# EAGLE design modulo_sensores (EAGLE 9.6.2)
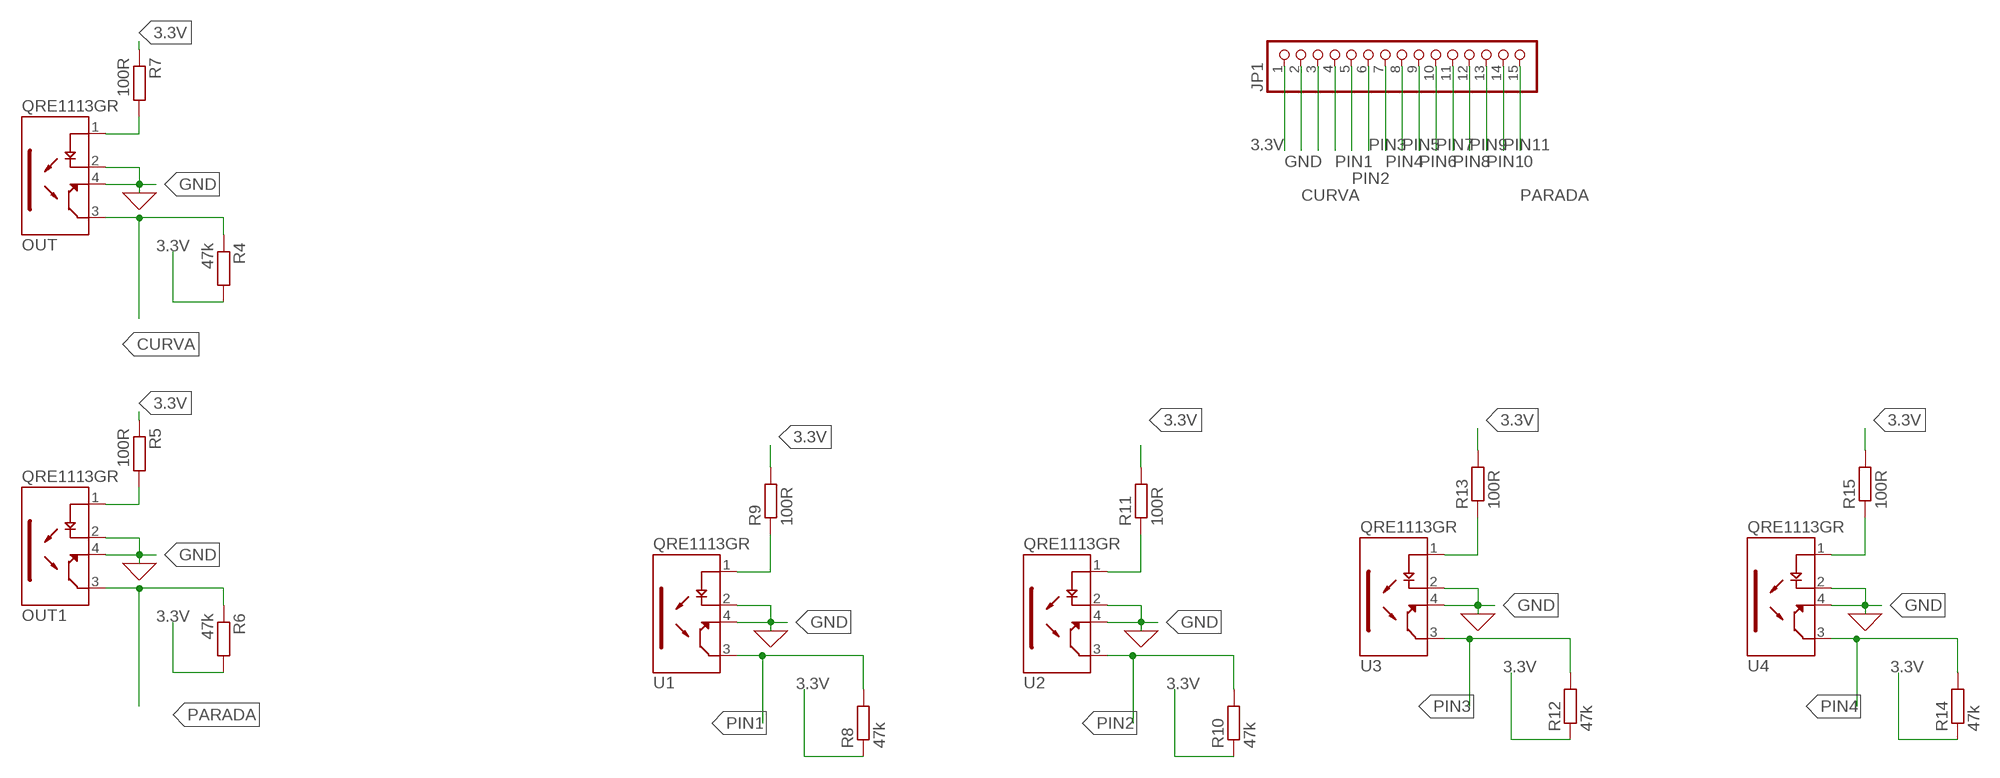
[diagram p0: schematic, sheet 1, part 1 of 2]
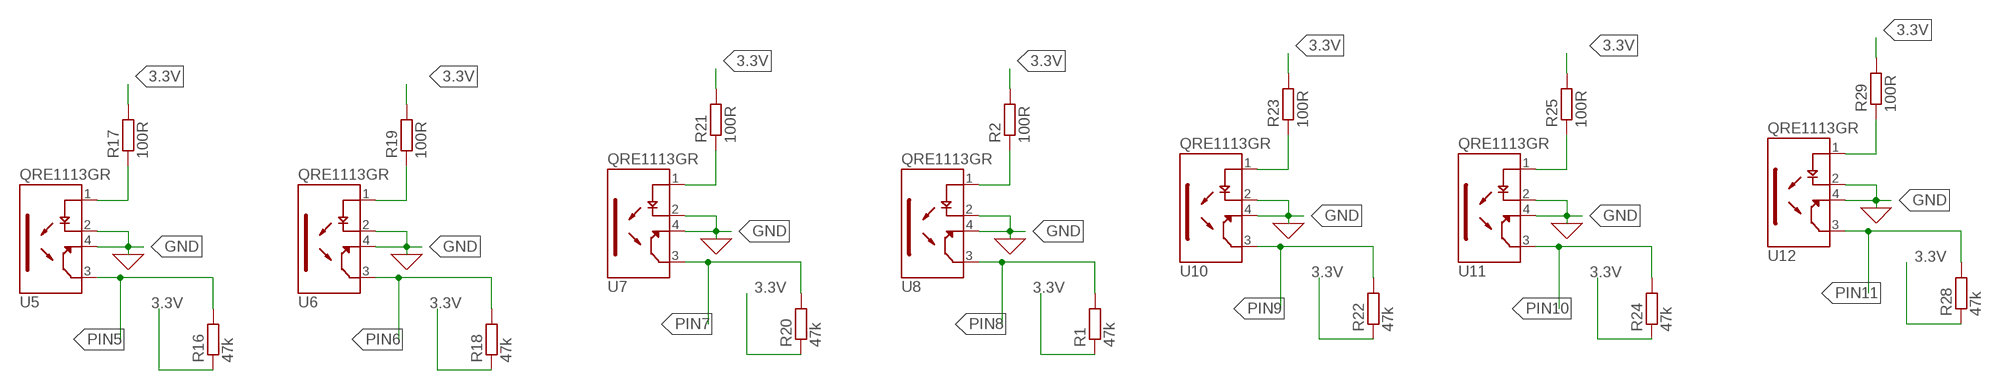
[diagram p1: schematic, sheet 1, part 2 of 2]

## Parts
JP1  PINHD-1X15  [1X15]
OUT  QRE1113GR  [SOIC180P460X187-4N]
OUT1  QRE1113GR  [SOIC180P460X187-4N]
R1  47k  R-EU_M0805  [M0805]
R2  100R  R-EU_M0805  [M0805]
R4  47k  R-EU_R0805  [R0805]
R5  100R  R-EU_R0805  [R0805]
R6  47k  R-EU_R0805  [R0805]
R7  100R  R-EU_R0805  [R0805]
R8  47k  R-EU_M0805  [M0805]
R9  100R  R-EU_M0805  [M0805]
R10  47k  R-EU_M0805  [M0805]
R11  100R  R-EU_M0805  [M0805]
R12  47k  R-EU_M0805  [M0805]
R13  100R  R-EU_M0805  [M0805]
R14  47k  R-EU_M0805  [M0805]
R15  100R  R-EU_M0805  [M0805]
R16  47k  R-EU_M0805  [M0805]
R17  100R  R-EU_M0805  [M0805]
R18  47k  R-EU_M0805  [M0805]
R19  100R  R-EU_M0805  [M0805]
R20  47k  R-EU_M0805  [M0805]
R21  100R  R-EU_M0805  [M0805]
R22  47k  R-EU_M0805  [M0805]
R23  100R  R-EU_M0805  [M0805]
R24  47k  R-EU_M0805  [M0805]
R25  100R  R-EU_M0805  [M0805]
R28  47k  R-EU_M0805  [M0805]
R29  100R  R-EU_M0805  [M0805]
U1  QRE1113GR  [SOIC180P460X187-4N]
U2  QRE1113GR  [SOIC180P460X187-4N]
U3  QRE1113GR  [SOIC180P460X187-4N]
U4  QRE1113GR  [SOIC180P460X187-4N]
U5  QRE1113GR  [SOIC180P460X187-4N]
U6  QRE1113GR  [SOIC180P460X187-4N]
U7  QRE1113GR  [SOIC180P460X187-4N]
U8  QRE1113GR  [SOIC180P460X187-4N]
U10  QRE1113GR  [SOIC180P460X187-4N]
U11  QRE1113GR  [SOIC180P460X187-4N]
U12  QRE1113GR  [SOIC180P460X187-4N]

## Nets
3.3V: JP1.1 R1.1 R2.2 R4.2 R5.1 R6.2 R7.1 R8.1 R9.2 R10.1 R11.2 R12.1 R13.2 R14.1 R15.2 R16.1 R17.2 R18.1 R19.2 R20.1 R21.2 R22.1 R23.2 R24.1 R25.2 R28.1 R29.2
CURVA: JP1.3 OUT.3(CT) R4.1
GND: JP1.2 OUT1.2(C) OUT1.4(ET) OUT.2(C) OUT.4(ET) U1.2(C) U1.4(ET) U2.2(C) U2.4(ET) U3.2(C) U3.4(ET) U4.2(C) U4.4(ET) U5.2(C) U5.4(ET) U6.2(C) U6.4(ET) U7.2(C) U7.4(ET) U8.2(C) U8.4(ET) U10.2(C) U10.4(ET) U11.2(C) U11.4(ET) U12.2(C) U12.4(ET)
N$1: R9.1 U1.1(A)
N$5: OUT.1(A) R7.2
N$6: R11.1 U2.1(A)
N$7: OUT1.1(A) R5.2
N$8: R13.1 U3.1(A)
N$9: R15.1 U4.1(A)
N$10: R17.1 U5.1(A)
N$11: R19.1 U6.1(A)
N$12: R21.1 U7.1(A)
N$13: R2.1 U8.1(A)
N$14: R23.1 U10.1(A)
N$16: R25.1 U11.1(A)
N$17: R29.1 U12.1(A)
PARADA: JP1.15 OUT1.3(CT) R6.1
PIN1: JP1.4 R8.2 U1.3(CT)
PIN2: JP1.5 R10.2 U2.3(CT)
PIN3: JP1.6 R12.2 U3.3(CT)
PIN4: JP1.7 R14.2 U4.3(CT)
PIN5: JP1.8 R16.2 U5.3(CT)
PIN6: JP1.9 R18.2 U6.3(CT)
PIN7: JP1.10 R20.2 U7.3(CT)
PIN8: JP1.11 R1.2 U8.3(CT)
PIN9: JP1.12 R22.2 U10.3(CT)
PIN10: JP1.13 R24.2 U11.3(CT)
PIN11: JP1.14 R28.2 U12.3(CT)

## Library data of the parts
JP1 = pinhead:PINHD-1X15: PIN HEADER
OUT OUT1 U1-U8 U10-U12 = QRE_SENSOR:QRE1113GR: QRE1113 Series 30 V 50 mA Miniature Reflective Object Sensor - SMD-4 Check prices <https://pricing.snapeda.com/parts/QRE1113GR/ON%20Semiconductor/view-part?ref=eda>; AVAILABILITY: In Stock; DESCRIPTION: Reflective Optical Sensor 0.039 (1mm) 4-SMD, Gull Wing; MF: ON Semiconductor; MP: QRE1113GR; PACKAGE: ARUSM-313-4 ON Semiconductor; PRICE: None; PURCHASE-URL: https://pricing.snapeda.com/search/part/QRE1113GR/?ref=eda
R1 R2 R4-R25 R28 R29 = rcl:R-EU_: RESISTOR, European symbol; SPICEPREFIX: R

## Board
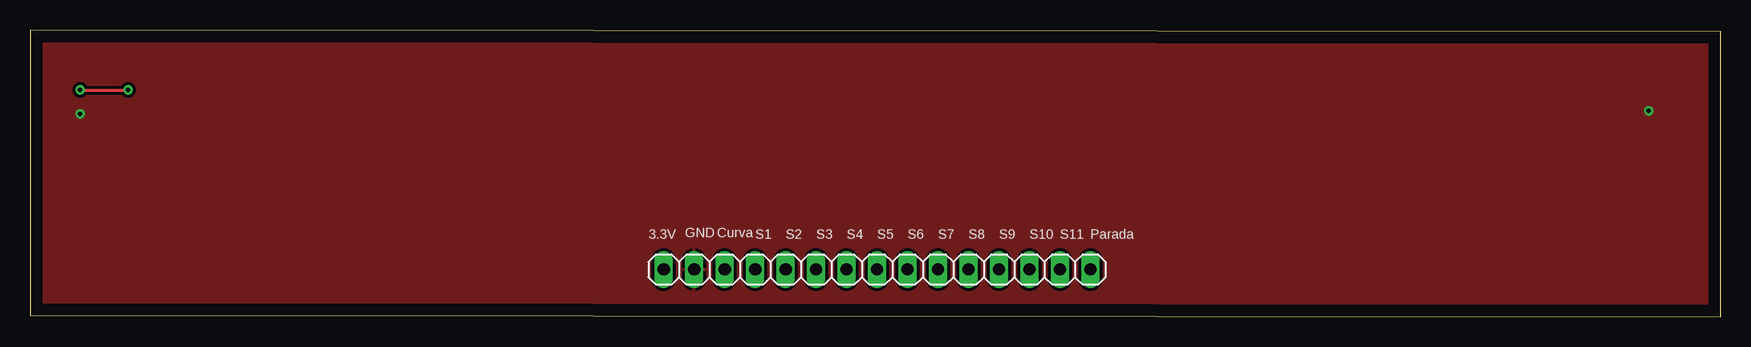
[diagram p2: board, top side]
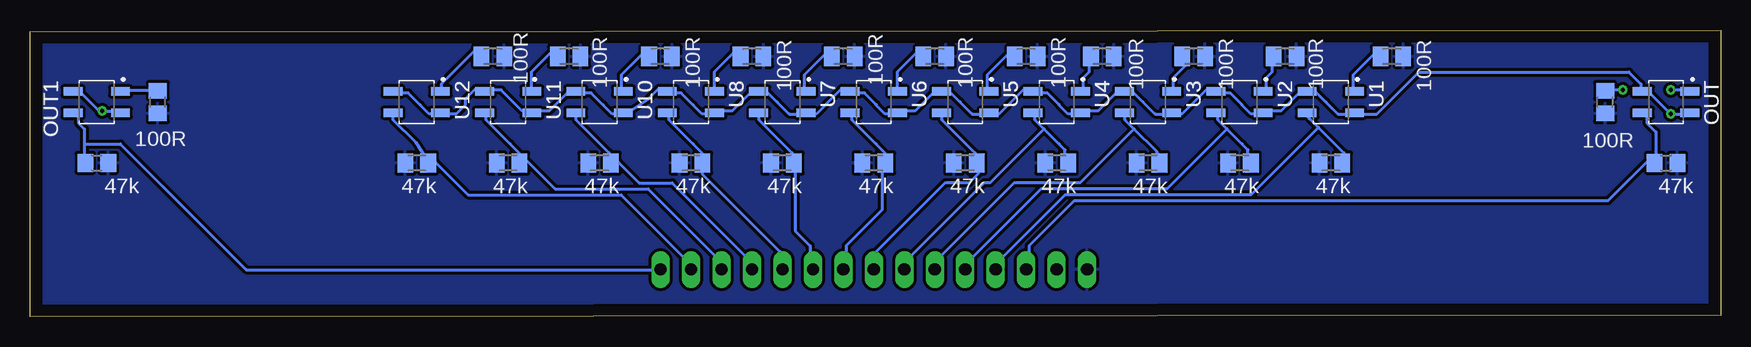
[diagram p3: board, bottom side, seen from below]

Size 140.95 x 23.93 mm. Coordinates in mm from the lower left corner, seen from the top.
Outline: 0,0.13 140.95,0 140.95,23.8 0,23.93 0,0.13
Copper layers (1*16): Top 0.035mm / dielectric 1.5mm / Bottom 0.035mm
Design rules "default *": minimum track width 0.25mm, minimum drill 0.35mm, track to track 0.25mm, track to pad 0.25mm, pad to pad 0.25mm, via to via 0.25mm, smd to smd 0.25mm, copper to edge 40mil, drill to drill 6mil, minimum pad ring 10mil, minimum via ring 8mil, stop-mask expansion 4mil, vias tented up to drill 0mil, thermal gap 10mil

### Footprints (pad centres in the part's own frame; a part is rotated, then mirrored left to right if it is on the bottom)
1X15 = drill 1.016 long: 1 -17.78,0; 2 -15.24,0; 3 -12.7,0; 4 -10.16,0; 5 -7.62,0; 6 -5.08,0; 7 -2.54,0; 8 0,0; 9 2.54,0; 10 5.08,0; 11 7.62,0; 12 10.16,0; 13 12.7,0; 14 15.24,0; 15 17.78,0
SOIC180P460X187-4N = smd 0.69 x 1.57: 1 -0.9,1.975; 2 -0.9,-1.975; 3 0.9,-1.975; 4 0.9,1.975
M0805 = smd 1.3 x 1.6: 1 -0.95,0; 2 0.95,0
R0805 = smd 1.3 x 1.5: 1 -0.95,0; 2 0.95,0

### Placement (x,y rotation side)
JP1  70.61,3.94 0 top
OUT  4.57,17.91 270 bottom
OUT1  135.38,17.91 270 bottom
R1  85.85,12.83 0 bottom
R2  80.77,21.72 0 bottom
R4  4.57,12.83 0 bottom
R5  130.3,17.91 90 bottom
R6  135.38,12.83 0 bottom
R7  9.65,17.91 90 bottom
R8  32.51,12.83 0 bottom
R9  27.43,21.72 0 bottom
R10  40.13,12.83 0 bottom
R11  36.32,21.72 0 bottom
R12  47.75,12.83 0 bottom
R13  43.94,21.72 0 bottom
R14  55.37,12.83 0 bottom
R15  51.56,21.72 0 bottom
R16  62.99,12.83 0 bottom
R17  57.91,21.72 0 bottom
R18  70.61,12.83 0 bottom
R19  65.53,21.72 0 bottom
R20  78.23,12.83 0 bottom
R21  73.15,21.72 0 bottom
R22  93.47,12.83 0 bottom
R23  88.39,21.72 0 bottom
R24  101.09,12.83 0 bottom
R25  96.01,21.72 0 bottom
R28  108.71,12.83 0 bottom
R29  102.36,21.72 0 bottom
U1  32.51,17.91 270 bottom
U2  40.13,17.91 270 bottom
U3  47.75,17.91 270 bottom
U4  55.37,17.91 270 bottom
U5  62.99,17.91 270 bottom
U6  70.61,17.91 270 bottom
U7  78.23,17.91 270 bottom
U8  85.85,17.91 270 bottom
U10  93.47,17.91 270 bottom
U11  101.09,17.91 270 bottom
U12  108.71,17.91 270 bottom

### Tracks (layer width: path | path; a pad name or v marks a point on that pad's centre or on a via)
3.3V
  pour Bottom: -3.05,-2.41 -3.05,28.07 143,28.07 143,-2.41
CURVA
  Bottom 0.25: OUT.3 6.42,17.18 6.17,16.93 6.17,16.18 5.42,15.43 5.42,12.93 R4.1 5.67,12.93 6.17,12.93 9.42,9.68 53.92,9.68 57.67,5.93 57.67,4.18 JP1.3
GND  (via drill 0.35)
  Bottom 0.25: U12.2 110.67,18.68 109.42,18.68 108.42,17.68 107.67,16.93 106.92,16.93 U12.4 106.67,16.93 105.42,16.93 104.67,17.68 104.67,18.18 103.92,18.93 103.17,18.93 U11.2 102.92,18.93 101.67,18.93 99.92,17.18 99.17,17.18 U11.4 98.92,17.18 97.67,17.18 96.17,18.68 95.67,18.68 U10.2 95.42,18.68 94.17,18.68 93.17,17.68 92.42,16.93 91.67,16.93 U10.4 91.42,16.93 91.29,16.93 89.42,18.18 88.67,18.93 87.92,18.93 U8.2 87.67,18.68 86.67,18.68 85.67,17.68 84.92,16.93 83.92,16.93 U8.4 83.67,17.18 82.42,17.18 80.92,18.68 80.42,18.68 U7.2 80.17,18.93 79.67,18.93 78.67,17.93 77.67,16.93 76.42,16.93 U7.4 76.17,16.93 75.4,16.93 74.17,18.16 74.17,18.18 73.42,18.93 72.67,18.93 U6.2 72.42,18.68 71.38,18.68 70.42,17.72 70.42,17.68 69.67,16.93 68.67,16.93 U6.4 68.42,17.18 67.17,17.18 65.67,18.68 65.17,18.68 U5.2 64.92,18.93 64.42,18.93 63.42,17.93 62.42,16.93 61.17,16.93 U5.4 60.92,16.93 60.16,16.93 58.92,18.17 58.92,18.18 58.17,18.93 57.42,18.93 U4.2 57.17,18.68 56.14,18.68 55.17,17.71 55.17,17.68 54.42,16.93 53.42,16.93 U4.4 53.17,17.18 51.92,17.18 50.42,18.68 49.92,18.68 U3.2 49.67,18.93 49.17,18.93 48.17,17.93 47.17,16.93 45.92,16.93 U3.4 45.67,16.93 44.92,16.93 43.67,18.18 42.92,18.93 42.17,18.93 U2.2 41.92,18.68 40.9,18.68 39.92,17.7 39.92,17.68 39.17,16.93 38.17,16.93 U2.4 37.92,17.18 36.67,17.18 35.17,18.68 34.67,18.68 U1.2 34.42,18.93 33.92,18.93 32.92,17.93 31.92,16.93 30.67,16.93 U1.4 30.42,16.93 28.67,16.93 25.17,20.43 7.67,20.43 6.67,19.43 6.67,18.93 OUT.2 6.42,18.68 5.92,18.68 v4.17,16.93 2.67,16.93 OUT.4
  Bottom 0.25: OUT1.4 133.42,17.18 v134.92,17.18 135.17,17.18 136.67,18.68 137.17,18.68 OUT1.2
  pour Top: -8.13,-4.95 -8.13,33.15 144.27,33.15 144.27,-4.95
N$1
  Bottom 0.25: U1.1 30.67,18.93 30.67,20.18 28.92,21.93 28.42,21.93 R9.1
N$5  (via drill 0.35)
  Top 0.25: v4.17,18.93 v8.17,18.93
  Bottom 0.25: v8.17,18.93 9.42,18.93 R7.2 | v4.17,18.93 2.67,18.93 OUT.1
N$6
  Bottom 0.25: U2.1 37.92,18.93 37.92,19.93 37.42,20.43 37.42,21.68 R11.1
N$7
  Bottom 0.25: R5.2 130.42,18.93 133.17,18.93 OUT1.1
N$8
  Bottom 0.25: U3.1 45.67,18.93 45.67,19.93 44.67,20.93 44.67,21.68 R13.1
N$9
  Bottom 0.25: U4.1 53.17,18.93 53.17,19.93 52.67,20.43 52.67,21.68 R15.1
N$10
  Bottom 0.25: U5.1 61.17,18.93 61.17,20.18 59.42,21.93 58.92,21.93 R17.1
N$11
  Bottom 0.25: U6.1 68.67,18.93 68.67,20.43 67.17,21.93 66.67,21.93 R19.1
N$12
  Bottom 0.25: U7.1 76.42,18.93 76.42,20.18 74.67,21.93 74.17,21.93 R21.1
N$13
  Bottom 0.25: U8.1 83.92,18.93 83.92,20.43 82.42,21.93 81.92,21.93 R2.1
N$14
  Bottom 0.25: U10.1 91.67,18.93 91.67,20.18 89.92,21.93 89.42,21.93 R23.1
N$16
  Bottom 0.25: U11.1 99.17,18.93 99.17,20.43 97.67,21.93 97.17,21.93 R25.1
N$17
  Bottom 0.25: U12.1 106.67,18.93 106.67,19.43 103.92,22.18 103.67,22.18 103.42,21.93 R29.1
PARADA
  Bottom 0.25: 136.42,14.43 136.42,15.68 136.92,16.18 136.92,16.93 137.17,17.18 OUT1.3 | 136.42,14.43 136.42,12.93 R6.1 | 136.42,14.43 133.42,14.43 122.92,3.93 88.42,3.93 JP1.15
PIN1
  Bottom 0.25: 33.55,15.8 31.42,13.68 31.42,12.93 R8.2 | U1.3 34.49,16.74 34.24,16.5 33.55,15.8 | 33.55,15.8 39.17,10.18 54.67,10.18 59.92,4.93 59.92,4.68 60.42,4.18 JP1.4
PIN2
  Bottom 0.25: 41.17,15.68 39.92,14.43 39.42,13.93 39.42,12.93 R10.2 | 41.17,15.68 41.92,16.43 41.92,16.93 U2.3 | 41.17,15.68 46.17,10.68 56.67,10.68 62.42,4.93 62.42,4.68 62.92,4.18 JP1.5
PIN3
  Bottom 0.25: 48.92,15.68 47.03,13.78 46.67,12.93 R12.2 | 48.92,15.68 49.67,16.43 49.67,16.93 U3.3 | 48.92,15.68 53.42,11.18 58.92,11.18 65.42,4.68 65.42,4.18 JP1.6
PIN4
  Bottom 0.25: 56.42,15.68 55.17,14.43 54.67,13.93 54.67,13.18 54.42,12.93 R14.2 | 56.42,15.68 57.17,16.43 57.17,16.93 U4.3 | 56.42,15.68 60.92,11.18 61.42,11.18 67.92,4.68 67.92,4.18 JP1.7
PIN5
  Bottom 0.25: U5.3 64.92,16.93 64.92,16.43 62.17,13.68 62.17,12.93 R16.2 61.92,12.68 61.92,11.93 62.67,11.18 64.67,11.18 70.42,5.43 70.42,4.18 JP1.8
PIN6
  Bottom 0.25: U6.3 72.42,16.93 72.42,16.43 70.42,14.43 69.42,13.43 69.42,12.93 R18.2 69.67,12.68 69.92,12.43 69.92,8.93 72.92,5.93 72.92,4.18 JP1.9
PIN7
  Bottom 0.25: U7.3 80.17,16.93 80.17,16.43 77.42,13.68 77.42,12.93 R20.2 77.17,12.68 77.17,7.18 75.92,5.93 75.92,4.18 JP1.10
PIN8
  Bottom 0.25: U8.3 87.67,16.93 87.67,16.43 85.67,14.43 84.67,13.43 84.67,12.93 R1.2 84.92,12.68 84.92,11.93 78.42,5.43 78.42,4.18 JP1.11
PIN9
  Bottom 0.25: U10.3 95.42,16.93 95.42,16.43 92.67,13.68 92.67,12.93 R22.2 92.42,12.93 91.92,12.93 90.17,11.18 87.42,11.18 80.92,4.68 80.92,4.18 JP1.12
PIN10
  Bottom 0.25: 99.92,13.43 100.92,14.43 102.92,16.43 102.92,16.93 U11.3 | 99.92,13.43 99.92,12.93 R24.2 99.92,13.43 | 99.92,13.43 97.17,10.68 89.42,10.68 83.42,4.68 83.42,4.18 JP1.13
PIN11
  Bottom 0.25: U12.3 110.67,16.93 110.67,16.43 108.78,14.53 107.92,13.25 107.92,12.93 R28.2 107.67,12.93 107.17,12.93 104.42,10.18 91.67,10.18 86.42,4.93 86.42,4.68 85.92,4.18 JP1.14

### Text on the board
_tNames: 3.3V | GND | Curva | S1 | S2 | S3 | S4 | S5 | S6 | S7 | S8 | S9 | S10 | S11 | Parada
_bNames: OUT | U1 | U1 | U2 | U2 | U3 | U3 | U4 | U4 | U5 | U5 | U6 | U6 | U7 | U7 | U8 | U8 | U10 | U10 | U11 | U11 | U12 | U12 | OUT1 | OUT1
__bNames: OUT | U1 | U2 | U3 | U4 | U5 | U6 | U7 | U8 | U10 | U11 | U12 | OUT1